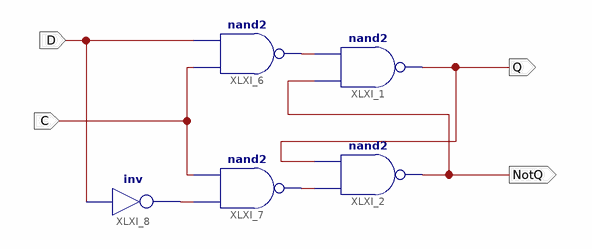
[diagram p0: schematic sheet 1]
// Xilinx ISE schematic D_Latch.sch (kintex7) as structural Verilog: 5 symbols, 4 ports
module D_Latch (
  input  D,
  input  C,
  output Q,
  output NotQ
);

  wire r, Reset, s;

  nand XLXI_1 (Q, NotQ, s);
  nand XLXI_2 (NotQ, r, Q);
  nand XLXI_6 (s, C, D);
  nand XLXI_7 (r, Reset, C);
  not XLXI_8 (Reset, D);
endmodule
